# Altium schematic sheet peroherals.SchDoc
size A4; SheetNumber: 5; SheetTotal: 5
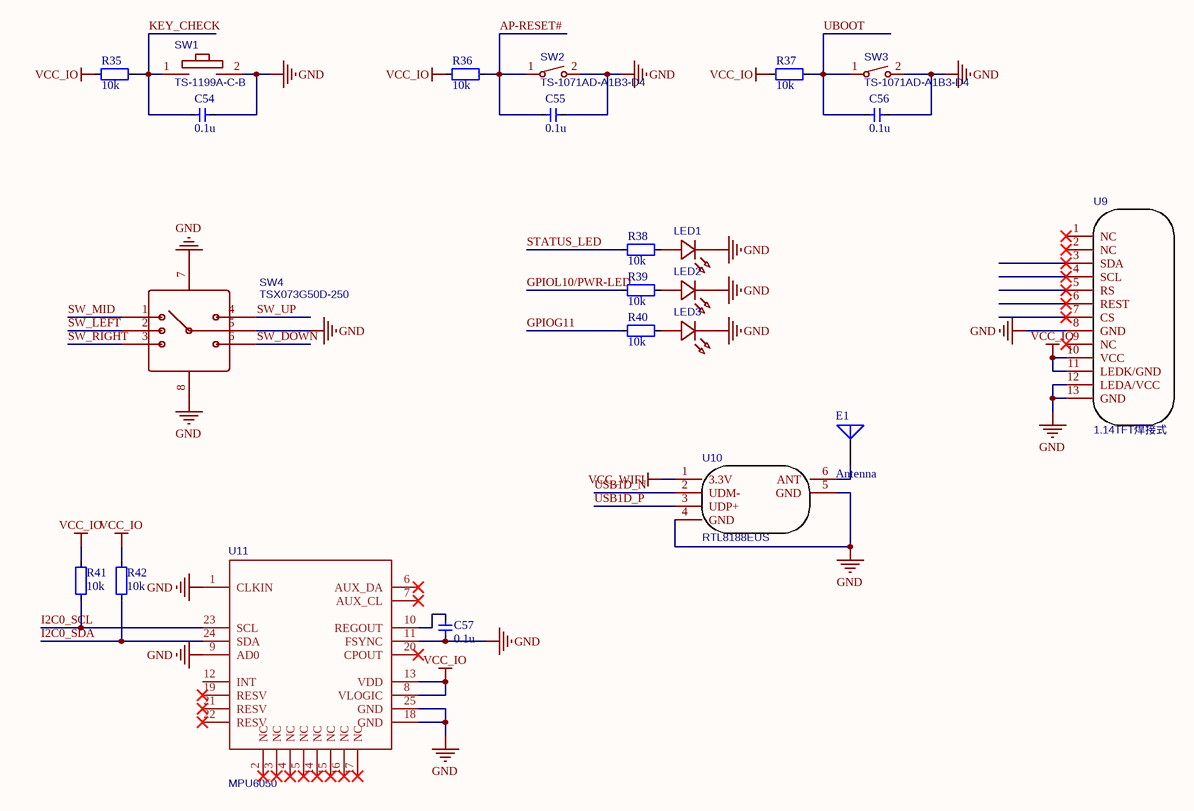
[diagram p0: peroherals.SchDoc]

## Parts
C54  value 0.1u  [C0402]  (hidden comment: CAP-0402)
C55  value 0.1u  [C0402]  (hidden comment: CAP-0402)
C56  value 0.1u  [C0402]  (hidden comment: CAP-0402)
C57  value 0.1u  [C0402]  (hidden comment: CAP-0402)
E1  Antenna  [PIN1]
LED1  TJ-S1005CL4T5ALC6B-A5  [LED0402-RD]  (value not drawn)
LED2  TJ-S1005CL4T5ALC6B-A5  [LED0402-RD]  (value not drawn)
LED3  TJ-S1005CL4T5ALC6B-A5  [LED0402-RD]  (value not drawn)
R35  value 10k  [R0402]  (hidden comment: RES-0402)
R36  value 10k  [R0402]  (hidden comment: RES-0402)
R37  value 10k  [R0402]  (hidden comment: RES-0402)
R38  value 10k  [R0402]  (hidden comment: RES-0402)
R39  value 10k  [R0402]  (hidden comment: RES-0402)
R40  value 10k  [R0402]  (hidden comment: RES-0402)
R41  value 10k  [R0402]  (hidden comment: RES-0402)
R42  value 10k  [R0402]  (hidden comment: RES-0402)
SW1  TS-1199A-C-B  [KEY-SMD_2P-L6.0-W6.0-P6.50]
SW2  TS-1071AD-A1B3-D4  [ButtonTACT_3x4x2_180]
SW3  TS-1071AD-A1B3-D4  [ButtonTACT_3x4x2_180]
SW4  TSX073G50D-250  [SW-SMD_TSX073G50D1-250]
U9  1.14TFT焊接式  [1.14TFT焊接式B]
U10  RTL8188EUS  [USB-WIFI-ANT]
U11  MPU6050  [QFN50P400X400X95-25T265X275N]

## Nets
GND: C54.1 C55.1 C56.1 C57.2 LED1.1(K) LED2.1(K) LED3.1(K) SW1.2 SW2.2 SW3.2 SW4.5(COM) SW4.7(GND) SW4.8(GND) U9.8(GND) U9.12(LEDA/VCC) U9.13(GND) U10.4(GND) U10.5(GND) U11.1(CLKIN) U11.9(AD0) U11.11(FSYNC) U11.18(GND) U11.25(GND)
VCC_IO: R35.2 R36.2 R37.2 R41.1 R42.1 U9.10(VCC) U9.11(LEDK/GND) U11.8(VLOGIC) U11.13(VDD)
VCC_WIFI: U10.1(3.3V)
AP-RESET#: C55.2 R36.1 SW2.1
GPIOG11: R40.2
GPIOL10/PWR-LED: R39.2
I2C0_SCL: R41.2 U11.23(SCL)
I2C0_SDA: R42.2 U11.24(SDA)
KEY_CHECK: C54.2 R35.1 SW1.1
STATUS_LED: R38.2
SW_DOWN: SW4.6(C)
SW_LEFT: SW4.2(CENTER)
SW_MID: SW4.1(A)
SW_RIGHT: SW4.3(B)
SW_UP: SW4.4(D)
UBOOT: C56.2 R37.1 SW3.1
USB1D_N: U10.2(UDM-)
USB1D_P: U10.3(UDP+)
NetC57_1: C57.1 U11.10(REGOUT)
NetE1_1: E1.1(A) U10.6(ANT)
NetLED1_2: LED1.2(A) R38.1
NetLED2_2: LED2.2(A) R39.1
NetLED3_2: LED3.2(A) R40.1

Not connected (* = marked no-connect by the designer): U9 1(NC)* 2(NC)* 3(SDA)* 4(SCL)* 5(RS)* 6(REST)* 7(CS)* 9(NC)*; U11 2(NC)* 3(NC)* 4(NC)* 5(NC)* 6(AUX_DA)* 7(AUX_CL)* 12(INT) 14(NC)* 15(NC)* 16(NC)* 17(NC)* 19(RESV)* 20(CPOUT)* 21(RESV)* 22(RESV)*

## Library data of the parts
C54-C57 = CAP-0402: Capacitor
E1 = Antenna: Generic Antenna; Published: 24-Mar-1999; LatestRevisionDate: 17-Jul-2002; LatestRevisionNote: Re-released for DXP Platform.; PackageReference: PIN1; Publisher: Altium Limited
LED1-LED3 = LED-0402: BOM_Manufacturer: TOGIALED; Contributor: LCSC; BOM_Supplier: LCSC; BOM_Supplier Part: C917189; BOM_Manufacturer Part: TJ-S1005CL4T5ALC6B-A5; BOM_JLCPCB Part Class: Extended Part; spicePre: L; spiceSymbolName: TJ-S1005CL4T5ALC6B-A5
R35-R42 = RES-0402: Resistor
SW1 = TS-1199A-C-B: BOM_Manufacturer: XKB Enterprise; Contributor: LCSC; BOM_Supplier: LCSC; BOM_Supplier Part: C318880; BOM_Manufacturer Part: TS-1199A-C-B; BOM_JLCPCB Part Class: Extended Part; spicePre: S; spiceSymbolName: TS-1199A-C-B
SW2 SW3 = TS-1071AD-A1B3-D4: BOM_Manufacturer: Yuandi; Contributor: LCSC; BOM_Supplier: LCSC; BOM_Supplier Part: C492878; BOM_Manufacturer Part: TS-1071AD-A1B3-D4; BOM_JLCPCB Part Class: Extended Part; spicePre: S; spiceSymbolName: TS-1071AD-A1B3-D4
SW4 = TSX073G50D-250: BOM_Manufacturer: BRIGHT; Contributor: LCSC; BOM_Supplier: LCSC; BOM_Supplier Part: C722953; BOM_Manufacturer Part: TSX073G50D-250; BOM_JLCPCB Part Class: Extended Part; spicePre: S; spiceSymbolName: TSX073G50D-250
U9 = 1.14TFT焊接式: BOM_Manufacturer: 中景园; BOM_Manufacturer Part: 1.14寸LCD; Contributor: lanlanzhilian; BOM_Supplier: LCSC; BOM_Supplier Part: 1.14寸LCD; link: https://item.taobao.com/item.htm?spm=a1z09.2.0.0.71822e8drxlmEN&id=586638527978&_u=v83q7ore291; spicePre: U; spiceSymbolName: 1.14TFT焊接式
U10 = RTL8188EUS: Contributor: Robin00; spicePre: U; spiceSymbolName: RTL8188EUS
U11 = MPU6050: spicePre: U; spiceSymbolName: MPU6050